# EAGLE board MusselBedHeater_RevG (EAGLE 9.6.1), part 1 of 2
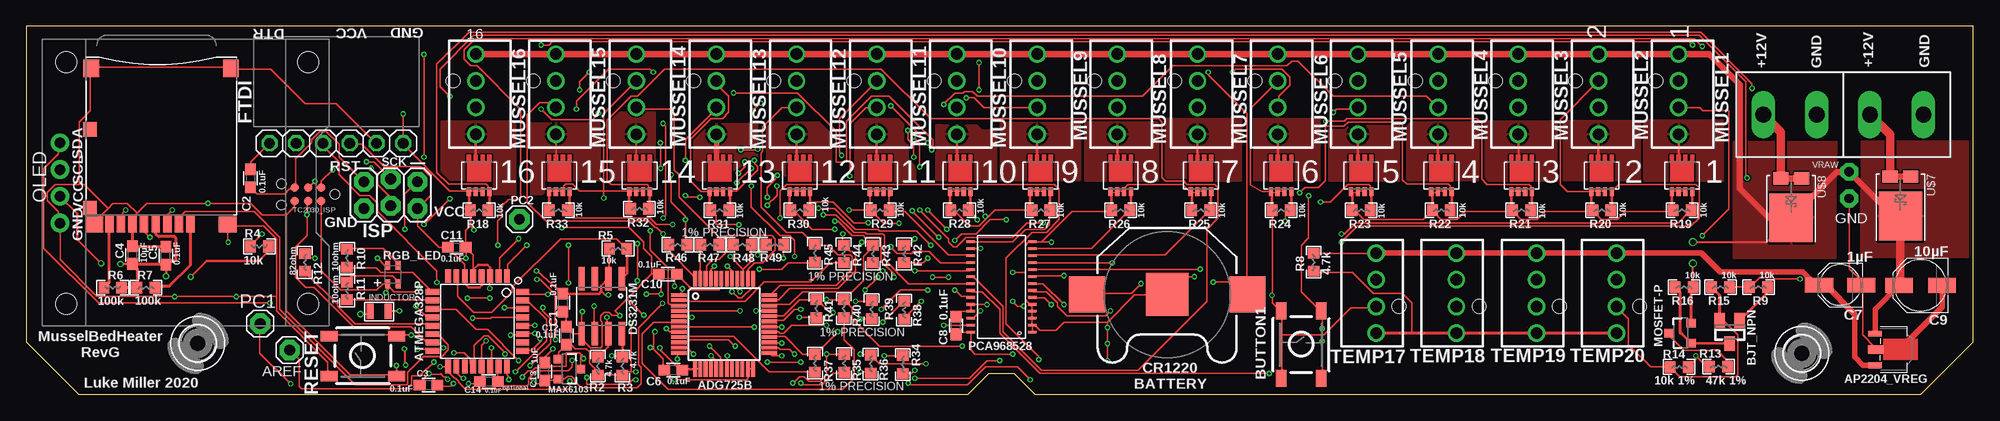
[diagram p1: board, top side]
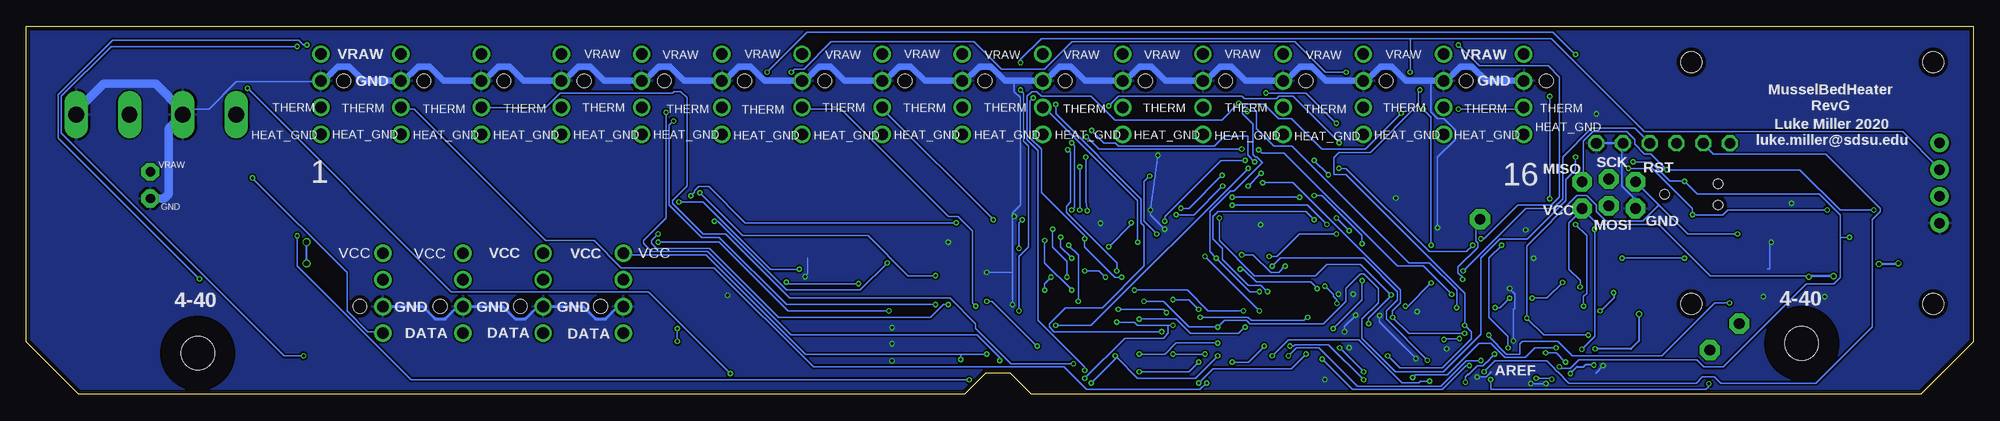
[diagram p2: board, bottom side, seen from below]

Size 185 x 35 mm. Coordinates in mm from the lower left corner, seen from the top.
Outline: 0,35 0,5 5,0 89.5,0 91.5,2 93.27,2.01 93.83,2.01 95.84,0 180,0 185,5 185,35 0,35
Copper layers (1*16): Top 0.035559375mm / dielectric 1.6mm / Bottom 0.035559375mm
Design rules "oshpark-2layer *": minimum track width 6mil, minimum drill 10mil, track to track 6mil, track to pad 6mil, pad to pad 6mil, via to via 6mil, smd to smd 6mil, copper to edge 15mil, drill to drill 6mil, minimum pad ring 5mil, minimum via ring 5mil, stop-mask expansion 2.5mil, vias tented up to drill 20mil, thermal gap 10mil

## Footprints (pad centres in the part's own frame; a part is rotated, then mirrored left to right if it is on the bottom)
TQFP48 = smd 1.5 x 0.35: 1 -4.3,2.75; 2 -4.3,2.25; 3 -4.3,1.75; 4 -4.3,1.25; 5 -4.3,0.75; 6 -4.3,0.25; 7 -4.3,-0.25; 8 -4.3,-0.75; 9 -4.3,-1.25; 10 -4.3,-1.75; 11 -4.3,-2.25; 12 -4.3,-2.75; 25 4.3,-2.75; 26 4.3,-2.25; 27 4.3,-1.75; 28 4.3,-1.25; 29 4.3,-0.75; 30 4.3,-0.25; 31 4.3,0.25; 32 4.3,0.75; 33 4.3,1.25; 34 4.3,1.75; 35 4.3,2.25; 36 4.3,2.75 | smd 0.35 x 1.5: 13 -2.75,-4.3; 14 -2.25,-4.3; 15 -1.75,-4.3; 16 -1.25,-4.3; 17 -0.75,-4.3; 18 -0.25,-4.3; 19 0.25,-4.3; 20 0.75,-4.3; 21 1.25,-4.3; 22 1.75,-4.3; 23 2.25,-4.3; 24 2.75,-4.3; 37 2.75,4.3; 38 2.25,4.3; 39 1.75,4.3; 40 1.25,4.3; 41 0.75,4.3; 42 0.25,4.3; 43 -0.25,4.3; 44 -0.75,4.3; 45 -1.25,4.3; 46 -1.75,4.3; 47 -2.25,4.3; 48 -2.75,4.3
SOT-89 = smd 0.55 x 1.3: P$1 -1.5,0; P$3 1.5,0 | smd 0.8 x 1.47: P$2 0,0.087
1X01 = drill 1.016 pad 1.93 octagon: 1 0,0
TQFP32-08 = smd 1.27 x 0.559: 1 -4.293,2.8; 2 -4.293,2; 3 -4.293,1.2; 4 -4.293,0.4; 5 -4.293,-0.4; 6 -4.293,-1.2; 7 -4.293,-2; 8 -4.293,-2.8; 17 4.293,-2.8; 18 4.293,-2; 19 4.293,-1.2; 20 4.293,-0.4; 21 4.293,0.4; 22 4.293,1.2; 23 4.293,2; 24 4.293,2.8 | smd 0.559 x 1.27: 9 -2.8,-4.293; 10 -2,-4.293; 11 -1.2,-4.293; 12 -0.4,-4.293; 13 0.4,-4.293; 14 1.2,-4.293; 15 2,-4.293; 16 2.8,-4.293; 25 2.8,4.293; 26 2,4.293; 27 1.2,4.293; 28 0.4,4.293; 29 -0.4,4.293; 30 -1.2,4.293; 31 -2,4.293; 32 -2.8,4.293
TERMINAL-2PIN-5.08MM_LARGEHOLE = drill 1.5 long: P$1 0,2.54; P$2 0,-2.54
SOT23 = smd 1 x 1.4: 1 -0.95,-1.1; 2 0.95,-1.1; 3 0,1.1
PUSHBUTTON_SPST_PTS525_SERIES = smd 1.6 x 1: P$1 -3.2,1.9; P$2 3.2,1.9; P$3 -3.2,-1.9; P$4 3.2,-1.9
0603 = smd 1.1 x 1: 1 -0.85,0; 2 0.85,0
PANASONIC_B = smd 2.667 x 1.4: + 2.006,0; - -2.006,0
PANASONIC_C = smd 2.6 x 1.4: + 2.05,0; - -2.05,0
DS3231M_SOIC8 = smd 0.61 x 2.21: 1 -1.905,-2.616; 2 -0.635,-2.616; 3 0.635,-2.616; 4 1.905,-2.616; 5 1.905,2.616; 6 0.635,2.616; 7 -0.635,2.616; 8 -1.905,2.616
1X06-RIGHT_ANGLE = drill 1.016 octagon: 1 0,0; 2 2.54,0; 3 5.08,0; 4 7.62,0; 5 10.16,0; 6 12.7,0
4-40-SCREW-HOLE = hole 3.2: 0,0
I_0805 = smd 0.7 x 1.45: P$1 -0.85,0; P$2 0.85,0
2X3_LOCK = drill 1.016 pad 1.88 octagon: 1 0,0; 2 0,2.54; 3 2.54,-0.254; 4 2.54,2.286; 5 5.08,0; 6 5.08,2.54
SOT23-3 = smd 0.8 x 0.9: 1 -0.95,-1; 2 0.95,-1; 3 0,1.1
MOLEX_KK_254_4PIN_HEADER = drill 1.1: P$1 0,0; P$2 2.54,0; P$3 5.08,0; P$4 7.62,0 | hole 1.3: 2.54,-2.159
OLED_0.96_I2C_GND_PIN1_WIDE = drill 1 pad 1.778: GND -0.004,-0.003; SCL 5.076,-0.003; SDA 7.616,-0.003; VCC 2.536,-0.003 | hole 2: -7.689,-23.599; 15.309,-23.599; 15.309,-0.603; -7.689,-0.603
28-TSSOP = smd 0.8 x 0.25: 1 -2.921,4.623; 2 -2.921,3.962; 3 -2.921,3.302; 4 -2.921,2.642; 5 -2.921,1.981; 6 -2.921,1.321; 7 -2.921,0.66; 8 -2.927,0; 9 -2.921,-0.66; 10 -2.921,-1.321; 11 -2.921,-1.981; 12 -2.921,-2.642; 13 -2.921,-3.302; 14 -2.921,-3.962; 15 2.921,-3.962; 16 2.921,-3.302; 17 2.921,-2.642; 18 2.921,-1.981; 19 2.921,-1.321; 20 2.921,-0.66; 21 2.927,0; 22 2.921,0.66; 23 2.921,1.321; 24 2.921,1.981; 25 2.921,2.642; 26 2.921,3.302; 27 2.921,3.962; 28 2.921,4.623
R0603 = smd 1 x 1.1: 1 -0.85,0; 2 0.85,0
LED_RGB_SMD_1.6X1.6 = smd 0.85 x 0.5: P$1 0.875,-0.5; P$2 -0.875,-0.5; P$3 -0.875,0.5; P$4 0.875,0.5
TC2030-MCP-NL = smd 0.787 x 0.787: 1 1.27,-0.635; 2 1.27,0.635; 3 2.54,-0.635; 4 2.54,0.635; 5 3.81,-0.635; 6 3.81,0.635 | hole 0.889: 0,0; 5.08,-1.016; 5.08,1.016
MICROSD_SOCKET_MOLEX_REVERSEMOUNT = smd 1.29 x 1.4: CARD_DETECT1 -0.645,8.12 | smd 1.29 x 1.3: CARD_DETECT2 -0.645,0.65 | smd 0.8 x 1.68: CS2 7.8,-0.84; GND6 3.4,-0.84; MISO7 2.3,-0.84; MOSI3 6.7,-0.84; NC1 8.9,-0.84; RES8 1.2,-0.84; SCK5 4.5,-0.84; VDD4 5.6,-0.84 | smd 1.6 x 1.5: MNT1 -0.2,-0.93 | smd 1.7 x 1.5: MNT2 12.45,-0.93 | smd 1.5 x 1.7: MNT3 -0.54,13.92; MNT4 12.75,13.92
CR1220_BATTERY_HOLDER_SMD = smd 4.064 x 4.064: GND 0,0 | smd 3.429 x 3.429: P$1 -7.62,0; P$2 7.62,0
TO-277-3 = smd 1.15 x 1.45: P$1 -2.75,-0.985; P$2 -2.75,0.985 | smd 4.65 x 4.15: P$3 1,0
SOT1210 = smd 0.4 x 0.83: 1 -0.975,-1.535; 2 -0.325,-1.535; 3 0.325,-1.535; 4 0.975,-1.535 | smd 0 x 0: MB 0,0.432
1X02_NOSILK = drill 0.9 pad 1.676 octagon: 1 -1.27,0; 2 1.27,0

## Placement (x,y rotation side)
ADG725B  ADG725_MUX  [TQFP48]  66.3,6.69 0 top
AP2204_VREG  AP2204R  [SOT-89]  175.69,4.26 270 top
AREF  PINHD-1X1STANDARD  [1X01]  25.02,4.19 0 top
ATMEGA328P  ATMEGA328P  [TQFP32-08]  42.87,6.92 270 top
BATT_INPUT1  TERMINAL-2PIN-5.08MMLARGEHOLE  [TERMINAL-2PIN-5.08MM_LARGEHOLE]  177.73,26.59 90 top
BATT_INPUT2  TERMINAL-2PIN-5.08MMLARGEHOLE  [TERMINAL-2PIN-5.08MM_LARGEHOLE]  167.59,26.59 90 top
BJT_NPN  BJT_NPN_FMMT619TA  [SOT23]  161.87,5.93 180 top
BUTTON1  PUSHBUTTON_DPST_SMD2SMALL  [PUSHBUTTON_SPST_PTS525_SERIES]  121.13,4.72 90 top
C1  0.1uF  [0603]  50.97,8.71 270 top
C2  0.1uF  [0603]  21.29,20.53 270 top
C3  0.1uF  [0603]  38.23,0.89 0 top
C4  10µF  [0603]  10.1,13.25 90 top
C5  0.1uF  [0603]  13.27,13.19 90 top
C6  0.1uF  [0603]  61.47,2.29 180 top
C7  1µF  [PANASONIC_B]  172.36,10.38 180 top
C8  0.1uF  [0603]  88.34,6.55 90 top
C9  10µF  [PANASONIC_C]  179.99,10.35 180 top
C10  0.1uF  [0603]  60.96,11.43 0 top
C11  0.1uF  [0603]  40.89,13.97 0 top
C12  0.1uF  [0603]  51.31,5.59 90 top
C13  1uF  [0603]  49.28,2.16 90 top
C14  0.1uF  [0603]  43.94,1.21 180 top
DS3231M  DS3231MSOIC-8  [DS3231M_SOIC8]  54.67,8.38 180 top
FTDI  [1X06-RIGHT_ANGLE]  23.11,23.88 0 top
H1  HOLE-LAYOUT4-40-SOCKET-HEAD  [4-40-SCREW-HOLE]  16.3,4.84 0 top
H2  HOLE-LAYOUT4-40-SOCKET-HEAD  [4-40-SCREW-HOLE]  168.7,3.91 0 top
INDUCTOR  INDUCTOR0805_TY  [I_0805]  33.53,7.87 0 top
ISP  AVR_SPI_PRG_62X3_LOCK  [2X3_LOCK]  37.17,20.21 180 top
MAX6103  MAX6100-MAX6107_VOLTAGE_REF  [SOT23-3]  51.56,2.41 270 top
MOSFET-P  MOSFET-PCHANNELBSH203  [SOT23-3]  157.21,5.83 90 top
MUSSEL1  MOLEX_KK_254_4_PIN_HEADER  [MOLEX_KK_254_4PIN_HEADER]  157.01,32.35 270 top
MUSSEL2  MOLEX_KK_254_4_PIN_HEADER  [MOLEX_KK_254_4PIN_HEADER]  149.39,32.35 270 top
MUSSEL3  MOLEX_KK_254_4_PIN_HEADER  [MOLEX_KK_254_4PIN_HEADER]  141.77,32.35 270 top
MUSSEL4  MOLEX_KK_254_4_PIN_HEADER  [MOLEX_KK_254_4PIN_HEADER]  134.15,32.35 270 top
MUSSEL5  MOLEX_KK_254_4_PIN_HEADER  [MOLEX_KK_254_4PIN_HEADER]  126.53,32.35 270 top
MUSSEL6  MOLEX_KK_254_4_PIN_HEADER  [MOLEX_KK_254_4PIN_HEADER]  118.91,32.35 270 top
MUSSEL7  MOLEX_KK_254_4_PIN_HEADER  [MOLEX_KK_254_4PIN_HEADER]  111.29,32.35 270 top
MUSSEL8  MOLEX_KK_254_4_PIN_HEADER  [MOLEX_KK_254_4PIN_HEADER]  103.67,32.35 270 top
MUSSEL9  MOLEX_KK_254_4_PIN_HEADER  [MOLEX_KK_254_4PIN_HEADER]  96.05,32.35 270 top
MUSSEL10  MOLEX_KK_254_4_PIN_HEADER  [MOLEX_KK_254_4PIN_HEADER]  88.43,32.35 270 top
MUSSEL11  MOLEX_KK_254_4_PIN_HEADER  [MOLEX_KK_254_4PIN_HEADER]  80.81,32.35 270 top
MUSSEL12  MOLEX_KK_254_4_PIN_HEADER  [MOLEX_KK_254_4PIN_HEADER]  73.19,32.35 270 top
MUSSEL13  MOLEX_KK_254_4_PIN_HEADER  [MOLEX_KK_254_4PIN_HEADER]  65.57,32.35 270 top
MUSSEL14  MOLEX_KK_254_4_PIN_HEADER  [MOLEX_KK_254_4PIN_HEADER]  57.95,32.35 270 top
MUSSEL15  MOLEX_KK_254_4_PIN_HEADER  [MOLEX_KK_254_4PIN_HEADER]  50.33,32.35 270 top
MUSSEL16  MOLEX_KK_254_4_PIN_HEADER  [MOLEX_KK_254_4PIN_HEADER]  42.71,32.35 270 top
OLED  OLED_0.96_I2CGND_PIN1_WIDE  [OLED_0.96_I2C_GND_PIN1_WIDE]  3.19,16.29 90 top
PC1  PINHD-1X1STANDARD  [1X01]  22.23,6.73 0 top
PC2  PINHD-1X1STANDARD  [1X01]  46.86,16.64 0 top
PCA9685  PCA968528  [28-TSSOP]  92.68,10.53 180 top
R2  4.7k  [R0603]  54.31,2.67 270 top
R3  4.7k  [R0603]  56.65,2.68 270 top
R4  10k  [R0603]  22.14,14.06 0 top
R5  10k  [R0603]  56.23,13.86 180 top
R6  100k  [R0603]  8.21,10.14 0 top
R7  100k  [R0603]  11.38,10.14 180 top
R8  4.7k  [R0603]  122.32,12.55 90 top
R9  10k  [R0603]  164.6,10.2 180 top
R10  10ohm  [R0603]  30.48,12.95 270 top
R11  10ohm  [R0603]  30.48,9.83 270 top
R12  82ohm  [R0603]  26.46,12.54 270 top
R13  47k 1%  [R0603]  160.8,2.63 180 top
R14  10k 1%  [R0603]  157.07,2.6 180 top
R15  10k  [R0603]  160.99,10.2 180 top
R16  10k  [R0603]  157.52,10.2 180 top
R18  10k  [R0603]  43.03,17.5 180 top
R19  10k  [R0603]  157.33,17.5 180 top
R20  10k  [R0603]  149.71,17.5 180 top
R21  10k  [R0603]  142.09,17.5 180 top
R22  10k  [R0603]  134.47,17.5 180 top
R23  10k  [R0603]  126.85,17.5 180 top
R24  10k  [R0603]  119.23,17.5 180 top
R25  10k  [R0603]  111.61,17.5 180 top
R26  10k  [R0603]  103.99,17.5 180 top
R27  10k  [R0603]  96.42,17.5 180 top
R28  10k  [R0603]  88.68,17.5 180 top
R29  10k  [R0603]  81.13,17.5 180 top
R30  10k  [R0603]  73.51,17.5 180 top
R31  10k  [R0603]  65.89,17.5 180 top
R32  10k  [R0603]  58.27,17.63 180 top
R33  10k  [R0603]  50.56,17.5 180 top
R34  Rref_1%  [R0603]  83.29,2.83 270 top
R35  Rref_1%  [R0603]  77.71,2.94 270 top
R36  Rref_1%  [R0603]  80.23,2.89 270 top
R37  Rref_1%  [R0603]  74.94,2.95 270 top
R38  Rref_1%  [R0603]  83.41,8.02 270 top
R39  Rref_1%  [R0603]  80.32,8.06 270 top
R40  Rref_1%  [R0603]  77.69,8.16 270 top
R41  Rref_1%  [R0603]  75.07,8.15 270 top
R42  Rref_1%  [R0603]  83.4,13.35 270 top
R43  Rref_1%  [R0603]  80.44,13.35 270 top
R44  Rref_1%  [R0603]  77.66,13.35 270 top
R45  Rref_1%  [R0603]  74.93,13.43 270 top
R46  Rref_1%  [R0603]  61.9,14.22 180 top
R47  Rref_1%  [R0603]  64.95,14.22 180 top
R48  Rref_1%  [R0603]  68.05,14.22 180 top
R49  Rref_1%  [R0603]  71.14,14.22 180 top
RESET  PUSHBUTTON_DPST_SMD2SMALL  [PUSHBUTTON_SPST_PTS525_SERIES]  31.98,3.65 180 top
RGB_LED  LED_3_COLOR_ANODE1  [LED_RGB_SMD_1.6X1.6]  34.83,11.39 270 top
TC2030_ISP  [TC2030-MCP-NL]  29.31,19.02 180 top
TEMP17  MOLEX_KK_254_4_PIN_HEADER  [MOLEX_KK_254_4PIN_HEADER]  128.27,5.81 90 top
TEMP18  MOLEX_KK_254_4_PIN_HEADER  [MOLEX_KK_254_4PIN_HEADER]  135.89,5.81 90 top
TEMP19  MOLEX_KK_254_4_PIN_HEADER  [MOLEX_KK_254_4PIN_HEADER]  143.51,5.81 90 top
TEMP20  MOLEX_KK_254_4_PIN_HEADER  [MOLEX_KK_254_4PIN_HEADER]  151.13,5.81 90 top
U$2  MICROSD_MOLEX_REVERSECURRENT  [MICROSD_SOCKET_MOLEX_REVERSEMOUNT]  6.7,17.07 0 top
U$5  BATTERY_BUTTON_CELLCR1220_SMD  [CR1220_BATTERY_HOLDER_SMD]  108.41,9.49 180 top
U$7  SCHOTTKY_DIODE_TO-277-3  [TO-277-3]  178.08,17.96 270 top
U$8  SCHOTTKY_DIODE_TO-277-3  [TO-277-3]  167.69,17.79 270 top
U$10  MOSFET-N_LFPAK33  [SOT1210]  43.03,20.8 0 top
U$11  MOSFET-N_LFPAK33  [SOT1210]  157.33,20.8 0 top
U$12  MOSFET-N_LFPAK33  [SOT1210]  149.68,20.8 0 top
U$13  MOSFET-N_LFPAK33  [SOT1210]  142.09,20.8 0 top
U$14  MOSFET-N_LFPAK33  [SOT1210]  134.47,20.8 0 top
U$15  MOSFET-N_LFPAK33  [SOT1210]  126.85,20.8 0 top
U$16  MOSFET-N_LFPAK33  [SOT1210]  119.23,20.8 0 top
U$17  MOSFET-N_LFPAK33  [SOT1210]  111.61,20.8 0 top
U$18  MOSFET-N_LFPAK33  [SOT1210]  103.99,20.8 0 top
U$19  MOSFET-N_LFPAK33  [SOT1210]  96.37,20.8 0 top
U$20  MOSFET-N_LFPAK33  [SOT1210]  88.75,20.8 0 top
U$21  MOSFET-N_LFPAK33  [SOT1210]  81.13,20.8 0 top
U$22  MOSFET-N_LFPAK33  [SOT1210]  73.51,20.8 0 top
U$23  MOSFET-N_LFPAK33  [SOT1210]  65.89,20.8 0 top
U$24  MOSFET-N_LFPAK33  [SOT1210]  58.27,20.8 0 top
U$25  MOSFET-N_LFPAK33  [SOT1210]  50.65,20.8 0 top
VRAW_TEST  PINHD-1X2NOSILK  [1X02_NOSILK]  173.22,19.89 270 top